# Altium schematic sheet AblationChannel.SchDoc
size A4
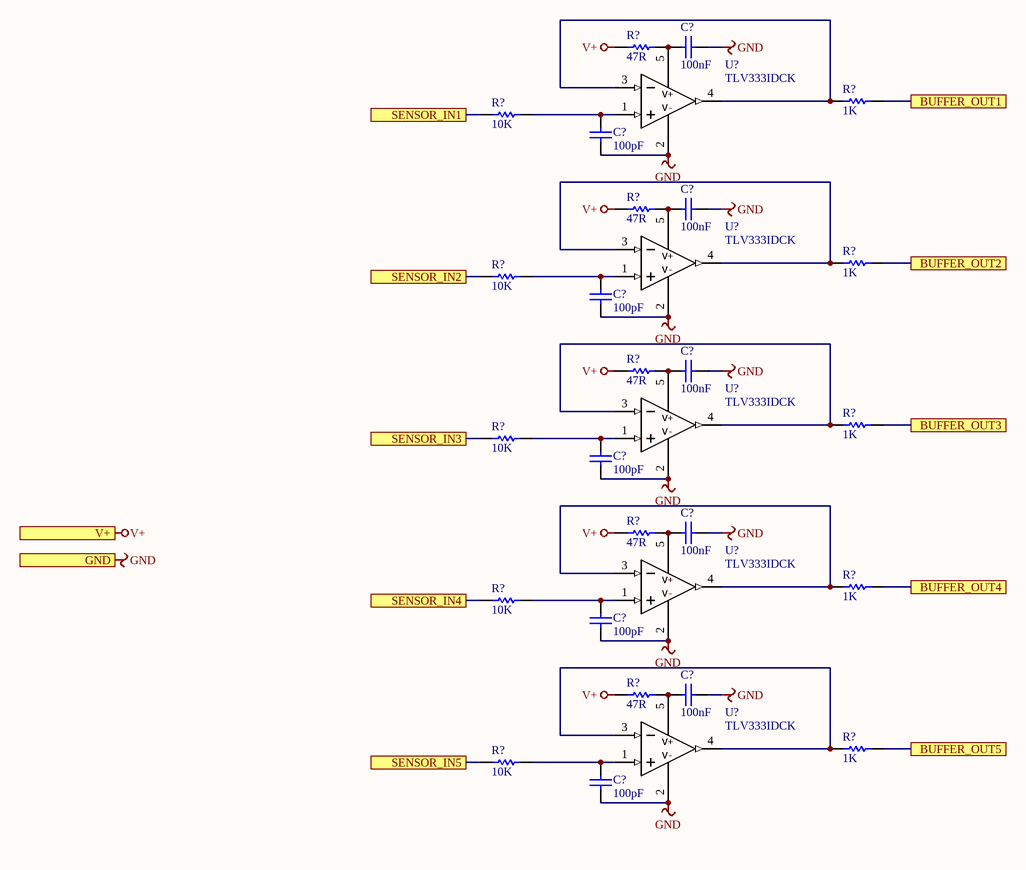
[diagram p0: AblationChannel.SchDoc]

## Parts
(Parts that share a designator on the sheet are numbered #1, #2 ... from top to bottom, then left to right.)
C?#1  100nF  [S0603C]
C?#2  100pF  [S0603C]
C?#3  100nF  [S0603C]
C?#4  100pF  [S0603C]
C?#5  100nF  [S0603C]
C?#6  100pF  [S0603C]
C?#7  100nF  [S0603C]
C?#8  100pF  [S0603C]
C?#9  100nF  [S0603C]
C?#10  100pF  [S0603C]
R?#1  47R  [S0603R]
R?#2  1K  [S0603R]
R?#3  10K  [S0603R]
R?#4  47R  [S0603R]
R?#5  1K  [S0603R]
R?#6  10K  [S0603R]
R?#7  47R  [S0603R]
R?#8  1K  [S0603R]
R?#9  10K  [S0603R]
R?#10  47R  [S0603R]
R?#11  1K  [S0603R]
R?#12  10K  [S0603R]
R?#13  47R  [S0603R]
R?#14  1K  [S0603R]
R?#15  10K  [S0603R]
U?#1  TLV333IDCK  [DCK0005A_N]
U?#2  TLV333IDCK  [DCK0005A_N]
U?#3  TLV333IDCK  [DCK0005A_N]
U?#4  TLV333IDCK  [DCK0005A_N]
U?#5  TLV333IDCK  [DCK0005A_N]

## Ports
BUFFER_OUT1, BUFFER_OUT2, BUFFER_OUT3, BUFFER_OUT4, BUFFER_OUT5, GND, SENSOR_IN1, SENSOR_IN2, SENSOR_IN3, SENSOR_IN4, SENSOR_IN5, V+

## Nets
GND: C?#1.1 C?#2.1 C?#3.1 C?#4.1 C?#5.1 C?#6.1 C?#7.1 C?#8.1 C?#9.1 C?#10.1 U?#1.2(V-) U?#2.2(V-) U?#3.2(V-) U?#4.2(V-) U?#5.2(V-) ; port GND
V+: R?#1.2 R?#4.2 R?#7.2 R?#10.2 R?#13.2 ; port V+
BUFFER_OUT1: R?#2.2 ; port BUFFER_OUT1
BUFFER_OUT2: R?#5.2 ; port BUFFER_OUT2
BUFFER_OUT3: R?#8.2 ; port BUFFER_OUT3
BUFFER_OUT4: R?#11.2 ; port BUFFER_OUT4
BUFFER_OUT5: R?#14.2 ; port BUFFER_OUT5
SENSOR_IN1: R?#3.1 ; port SENSOR_IN1
SENSOR_IN2: R?#6.1 ; port SENSOR_IN2
SENSOR_IN3: R?#9.1 ; port SENSOR_IN3
SENSOR_IN4: R?#12.1 ; port SENSOR_IN4
SENSOR_IN5: R?#15.1 ; port SENSOR_IN5
NetC?#1_2: C?#1.2 R?#1.1 U?#1.5(V+)
NetC?#2_2: C?#2.2 R?#3.2 U?#1.1(IN+)
NetC?#3_2: C?#3.2 R?#4.1 U?#2.5(V+)
NetC?#4_2: C?#4.2 R?#6.2 U?#2.1(IN+)
NetC?#5_2: C?#5.2 R?#7.1 U?#3.5(V+)
NetC?#6_2: C?#6.2 R?#9.2 U?#3.1(IN+)
NetC?#7_2: C?#7.2 R?#10.1 U?#4.5(V+)
NetC?#8_2: C?#8.2 R?#12.2 U?#4.1(IN+)
NetC?#9_2: C?#9.2 R?#13.1 U?#5.5(V+)
NetC?#10_2: C?#10.2 R?#15.2 U?#5.1(IN+)
NetR?#2_1: R?#2.1 U?#1.3(IN-) U?#1.4(OUT)
NetR?#5_1: R?#5.1 U?#2.3(IN-) U?#2.4(OUT)
NetR?#8_1: R?#8.1 U?#3.3(IN-) U?#3.4(OUT)
NetR?#11_1: R?#11.1 U?#4.3(IN-) U?#4.4(OUT)
NetR?#14_1: R?#14.1 U?#5.3(IN-) U?#5.4(OUT)

## Library data of the parts
C?#1 C?#3 C?#5 C?#7 C?#9 = 100nF/0603/50V: 精度 ±10% / 容值 100nF / 额定电压 50V / 温漂系数（介质材料) X7R; Manufacturer: FH(风华); A_Manufacturer: 元六; Code: 0603B104K500NT; A_Code: J CT41-0603-2R1-50V-104K; CompType: Capacitor; A_ComType: 二类电容; DistributorCode: C30926; Package: 0603
C?#2 C?#4 C?#6 C?#8 C?#10 = 100pF/0603/50V: 精度 ±5% / 容值 100pF / 额定电压 50V / 温漂系数（介质材料) C0G; Manufacturer: FH(风华); A_Manufacturer: 元六; Code: 0603CG101J500NT; A_Code: J CC41-0603-CG-50V-101J; CompType: Capacitor; A_ComType: 一类电容; DistributorCode: C1635; Package: 0603
R?#1 R?#4 R?#7 R?#10 R?#13 = 47R/0603: 精度 ±1% / 温度系数 ±100ppm/℃ / 阻值 47Ω / 功率 0.1W; Manufacturer: FH(风华); A_Manufacturer: 718; Code: RS-03K47R0FT; A_Code: J-RM1608(0603)-K-B-47R-F; CompType: Resistor; A_ComType: RM型片式膜固定电阻器; DistributorCode: C140087; Package: 0603
R?#2 R?#5 R?#8 R?#11 R?#14 = 1K/0603: 精度 ±1% / 温度系数 ±100ppm/℃ / 阻值 1kΩ / 功率 0.1W; Manufacturer: FH(风华); A_Manufacturer: 718; Code: RS-03K1001FT; A_Code: J-RM1608(0603)-K-B-1K-F; CompType: Resistor; A_ComType: RM型片式膜固定电阻器; DistributorCode: C115325; Package: 0603
R?#3 R?#6 R?#9 R?#12 R?#15 = 10K/0603: 精度 ±1% / 温度系数 ±100ppm/℃ / 阻值 10kΩ / 功率 0.1W; Manufacturer: FH(风华); A_Manufacturer: 718; Code: RS-03K1002FT; A_Code: J-RM1608(0603)-K-B-10K-F; CompType: Resistor; A_ComType: RM型片式膜固定电阻器; DistributorCode: C115324; Package: 0603
U?#1-U?#5 = TLV333IDCK: 电源电压 1.8V ~ 5.5V, ±0.9V ~ 2.75V / 增益带宽积（GBP） 350kHz / 压摆率（SR） 0.16 V/us / 工作温度 -40°C ~ 125°C /; Manufacturer: TI(德州仪器); CompType: 运放; DistributorCode: C181502; Package: SC-70-5; Code: TLV333IDCK; A_Code: -; A_Manufacturer: -; A_ComType: -